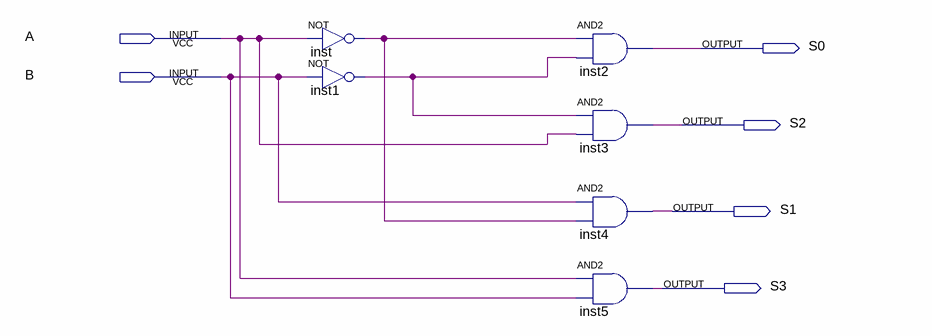
[diagram p0: schematic sheet]
// Quartus schematic decoder2_4.bdf as structural Verilog: 6 symbols, 6 pins
module decoder2_4 (
  input  A,
  input  B,
  output S0,
  output S2,
  output S1,
  output S3
);

  wire inst1_out, inst_out;

  not inst (inst_out, A);
  not inst1 (inst1_out, B);
  and inst2 (S0, inst_out, inst1_out);
  and inst3 (S2, inst1_out, A);
  and inst4 (S1, B, inst_out);
  and inst5 (S3, A, B);
endmodule
